# EAGLE design avr-grundschaltung (EAGLE 5.08)
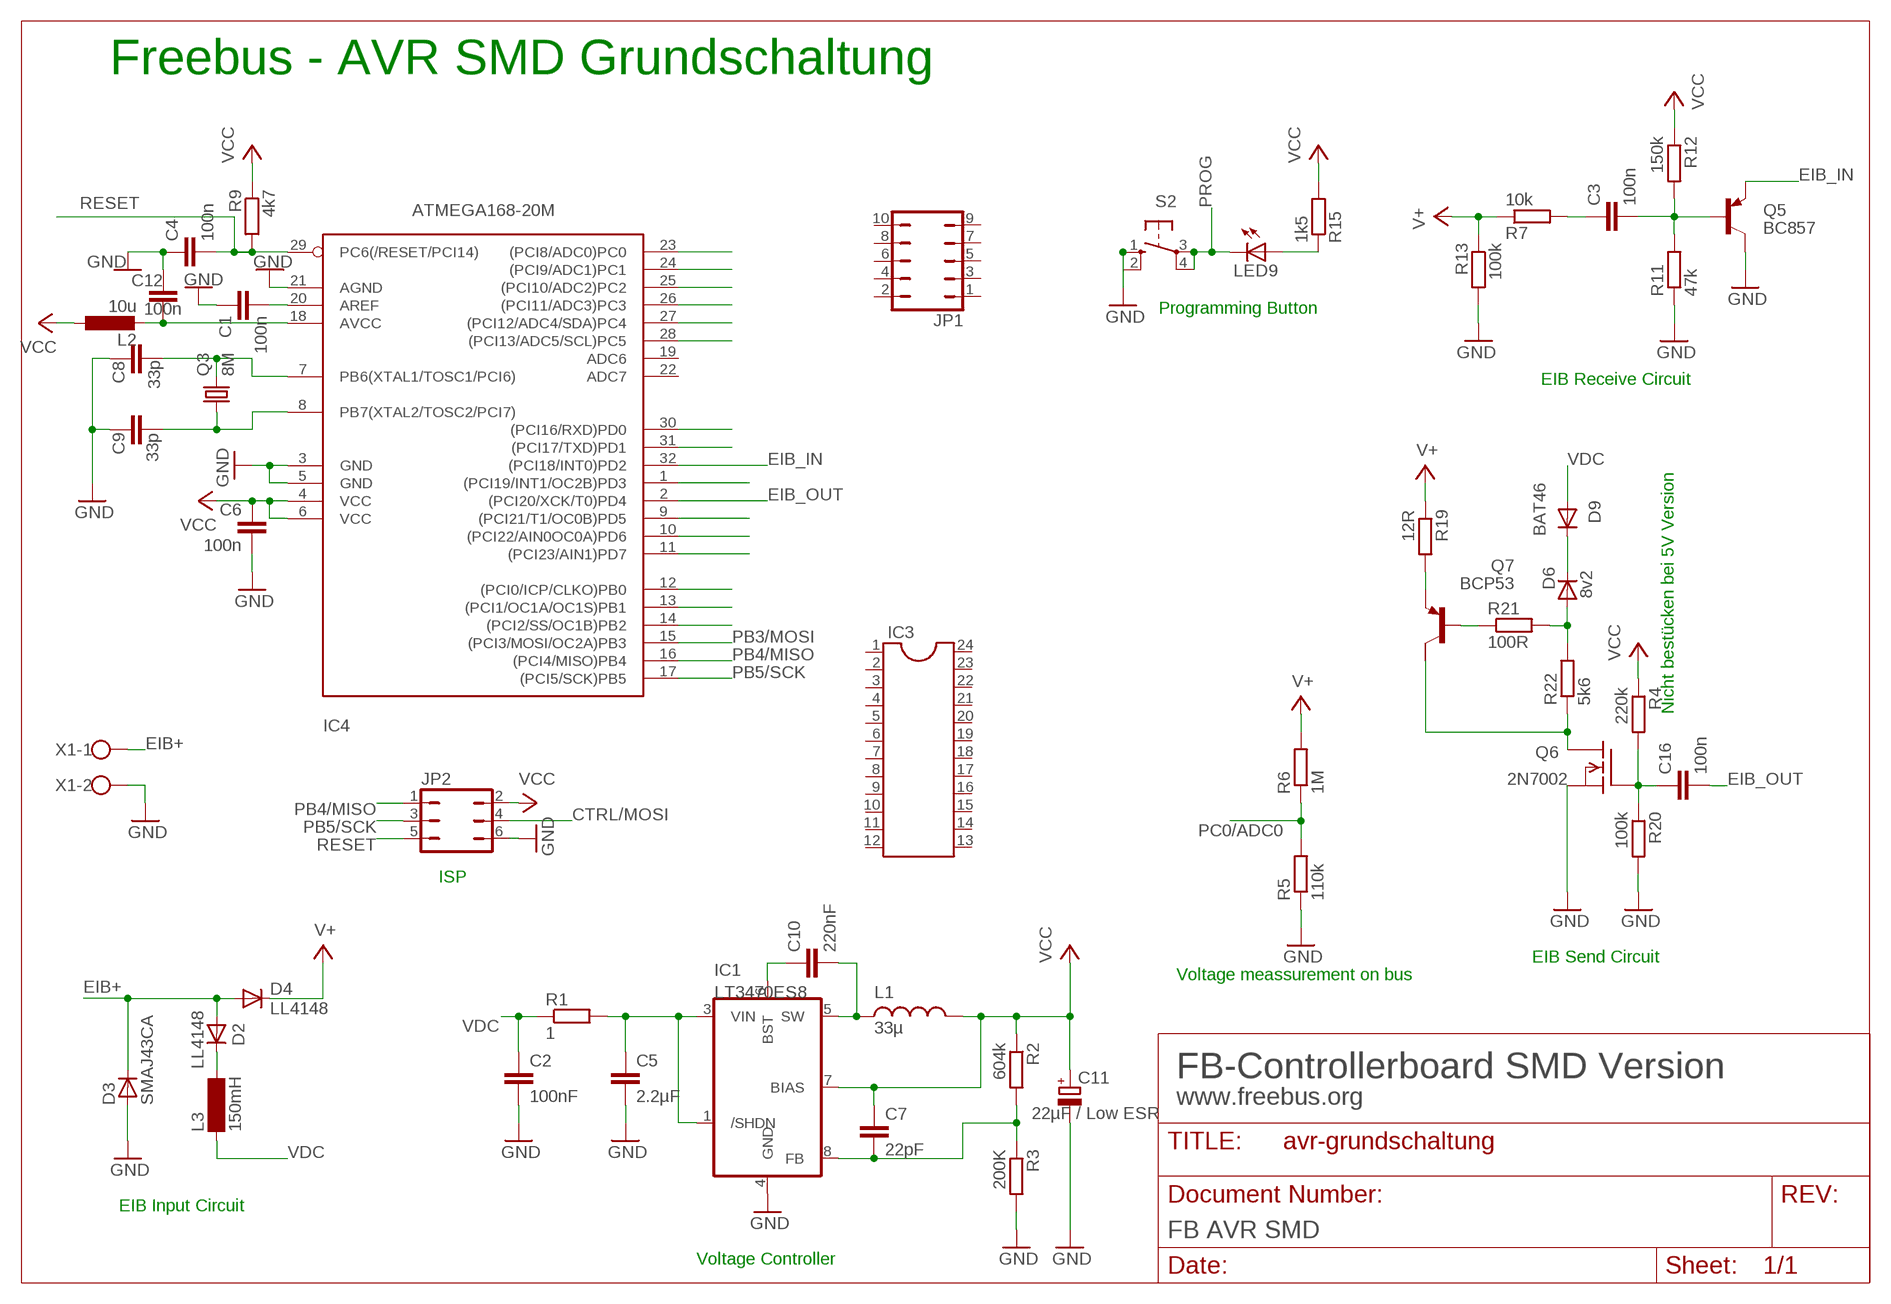
[diagram p0: schematic, sheet 1]

## Parts
C1  100n  C-EUC0603  [C0603]
C2  100nF  C-EUC0805K  [C0805K]
C3  100n  C-EUC0603  [C0603]
C4  100n  C-EUC0603  [C0603]
C5  2.2µF  C-EUC1206K  [C1206K]
C6  100n  C-EUC0603  [C0603]
C7  22pF  C-EUC0603K  [C0603K]
C8  33p  C-EUC0603  [C0603]
C9  33p  C-EUC0603  [C0603]
C10  220nF  C-EUC0805  [C0805]
C11  22µF / Low ESR  CPOL-EUC/6032-28R  [C/6032-28R]
C12  100n  C-EUC0805  [C0805]
C16  100n  C-EUC0603  [C0603]
D2  LL4148  [MINIMELF]
D3  SMAJ43CA  D-  [SMA]
D4  LL4148  [MINIMELF]
D6  8v2  DIODE-MINIMELF  [MINIMELF]
D9  BAT46  DIODE-MINIMELF  [MINIMELF]
IC1  LT3470ES8  LT3470EETS8  [TSOT23-8]
IC3  DIL24-9  [DIL24-9]
IC4  ATMEGA168-20M  [MLF32]
JP1  JP5Q  [JP5Q]
JP2  JP3Q  [JP3Q]
L1  33µ  DS1605C  [DS1605]
L2  10u  L-EUL2825P  [L2825P]
L3  150mH  SD12-1000  [SD12_1000]
LED9  LEDCHIP-LED0805  [CHIP-LED0805]
Q3  8M  CRYSTALHC49UP  [HC49UP]
Q5  BC857  BC857ASMD  [SOT23-BEC]
Q6  2N7002  [SOT23]
Q7  BCP53  FZT753SMD  [SOT223]
R1  1  R-EU_R0805  [R0805]
R2  604k  R-EU_R0805  [R0805]
R3  200K  R-EU_R0805  [R0805]
R4  220k  R-EU_R0603  [R0603]
R5  110k  R-EU_R0805  [R0805]
R6  1M  R-EU_R0805  [R0805]
R7  10k  R-EU_R0603  [R0603]
R9  4k7  R-EU_R0603  [R0603]
R11  47k  R-EU_R0603  [R0603]
R12  150k  R-EU_R0603  [R0603]
R13  100k  R-EU_R0603  [R0603]
R15  1k5  R-EU_R0603  [R0603]
R19  12R  R-EU_R0603  [R0603]
R20  100k  R-EU_R0603  [R0603]
R21  100R  R-EU_R0603  [R0603]
R22  5k6  R-EU_R0603  [R0603]
S2  10-XX  [B3F-10XX]
X1  W237-02P  [W237-132]

## Nets
CTRL/MOSI: JP2.4
EIB+ [supply]: D2.A D3.1(C) D4.A X1.1
EIB_IN: IC4.32((PCI18/INT0)PD2) Q5.E
EIB_OUT: C16.2 IC4.2((PCI20/XCK/T0)PD4)
GND [supply]: C1.1 C2.2 C4.1 C5.2 C6.2 C8.1 C9.1 C11.- C12.1 D3.2(A) IC1.4(GND) IC4.3(GND) IC4.5(GND) IC4.21(AGND) JP2.6 Q5.C Q6.2(S) R3.2 R5.1 R11.1 R13.2 R20.2 S2.1(S) S2.2(S1) X1.2
N$1: C7.2 IC1.8(FB) R2.2 R3.1
N$2: C1.2 IC4.20(AREF)
N$3: C10.1 IC1.6(BST)
N$4: C5.1 IC1.1(/SHDN) IC1.3(VIN) R1.2
N$5: D2.C L3.2
N$6: C12.2 IC4.18(AVCC) L2.2
N$7: C10.2 IC1.5(SW) L1.P$2
N$8: C8.2 IC4.7(PB6(XTAL1/TOSC1/PCI6)) Q3.2
N$9: C9.2 IC4.8(PB7(XTAL2/TOSC2/PCI7)) Q3.1
N$10: C3.1 R7.2
N$15 [supply]: C3.2 Q5.B R11.2 R12.2
N$17 [supply]: Q6.3(D) Q7.2(C) R22.1
N$18 [supply]: Q7.3(E) R19.2
N$19: LED9.A R15.1
N$23 [supply]: Q7.1(B) R21.1
N$25 [supply]: D6.A R21.2 R22.2
N$26: C16.1 Q6.1(G) R4.2 R20.1
N$28 [supply]: D6.C D9.C
PB0: IC4.12((PCI0/ICP/CLKO)PB0)
PB1/OC1A/PWM1: IC4.13((PCI1/OC1A/OC1S)PB1)
PB2/OC1B/PWM2: IC4.14((PCI2/SS/OC1B)PB2)
PB3/MOSI: IC4.15((PCI3/MOSI/OC2A)PB3)
PB4/MISO: IC4.16((PCI4/MISO)PB4) JP2.1
PB5/SCK: IC4.17((PCI5/SCK)PB5) JP2.3
PC0/ADC0: IC4.23((PCI8/ADC0)PC0) R5.2 R6.1
PC1/ADC1: IC4.24((PCI9/ADC1)PC1)
PC2/ADC2: IC4.25((PCI10/ADC2)PC2)
PC3/ADC3: IC4.26((PCI11/ADC3)PC3)
PC4/ADC4/SDA: IC4.27((PCI12/ADC4/SDA)PC4) IC4.28((PCI13/ADC5/SCL)PC5)
PD0/RXD: IC4.30((PCI16/RXD)PD0)
PD1/TXD: IC4.31((PCI17/TXD)PD1)
PD3/INT1: IC4.1((PCI19/INT1/OC2B)PD3)
PD5/T1: IC4.9((PCI21/T1/OC0B)PD5)
PD6/AIN0: IC4.10((PCI22/AIN0OC0A)PD6)
PD7/AIN1: IC4.11((PCI23/AIN1)PD7)
PROG: LED9.C S2.3(P) S2.4(P1)
RESET: C4.2 IC4.29(PC6(/RESET/PCI14)) JP2.5 R9.2
V+ [supply]: D4.C R6.2 R7.1 R13.1 R19.1
VCC [supply]: C6.1 C7.1 C11.+ IC1.7(BIAS) IC4.4(VCC) IC4.6(VCC) JP2.2 L1.P$1 L2.1 R2.1 R4.1 R9.1 R12.1 R15.2
VDC [supply]: C2.1 D9.A L3.1 R1.1
Unconnected: IC3.1 IC3.2 IC3.3 IC3.4 IC3.5 IC3.6 IC3.7 IC3.8 IC3.9 IC3.10 IC3.11 IC3.12 IC3.13 IC3.14 IC3.15 IC3.16 IC3.17 IC3.18 IC3.19 IC3.20 IC3.21 IC3.22 IC3.23 IC3.24 IC4.19(ADC6) IC4.22(ADC7) JP1.1 JP1.2 JP1.3 JP1.4 JP1.5 JP1.6 JP1.7 JP1.8 JP1.9 JP1.10 Q7.4(C/)

## Notes on the sheet
- Freebus - AVR SMD Grundschaltung
- Programming Button
- EIB Receive Circuit
- Nicht bestücken bei 5V Version
- ISP
- EIB Send Circuit
- Voltage meassurement on bus
- FB-Controllerboard SMD Version
- www.freebus.org
- EIB Input Circuit
- FB AVR SMD
- Voltage Controller

## Library data of the parts
C1-C10 C12 C16 = rcl:C-EU: CAPACITOR, European symbol
C11 = rcl:CPOL-EU: POLARIZED CAPACITOR, European symbol
D2 D4 = diode-os:LL4148
D3 = own:D-: DIODE unfilled
D6 D9 = diode:DIODE-: DIODE
IC1 = own:LT3470*: Micropower Buck Regulator
IC3 = ic-package:DIL24: Dual In Line
IC4 = avr:ATMEGA168: MICROCONTROLLER 16 kBytes FLASH 1 kBytes SRAM 512 Bytes EEPROM USART 8-channel 10 bit ADC
JP1 = jumper:JP5Q: JUMPER
JP2 = jumper:JP3Q: JUMPER
L1 = own:DS1605: SMT Power Inductors
L2 = rcl:L-EU: INDUCTOR, European symbol
L3 = inductor-neosid:SD12: INDUCTOR nominal inductance
LED9 = led:LED: LED OSRAM: - CHIPLED LG R971, LG N971, LY N971, LG Q971, LY Q971, LO R971, LY R971 LH N974, LH R974 LS Q976, LO Q976, LY Q976 LO Q996 - Hyper CHIPLED LW Q18S LB Q993, LB Q99A, LB R99A - SideLED LS A670, LO A670, LY A670, LG A670, LP A670 LB A673, LV A673, LT A673, LW A673 LH A674 LY A675 LS A676, LA A676, LO A676, LY A676, LW A676 LS A679, LY A679, LG A679 - Hyper Micro SIDELED® LS Y876, LA Y876, LO Y876, LY Y876 LT Y87S - SmartLED LW L88C, LW L88S LB L89C, LB L89S, LG L890 LS L89K, LO L89K, LY L89K LS L896, LA L896, LO L896, LY L896 - TOPLED LS T670, LO T670, LY T670, LG T670, LP T670 LSG T670, LSP T670, LSY T670, LOP T670, LYG T670 LG T671, LOG T671, LSG T671 LB T673, LV T673, LT T673, LW T673 LH T674 LS T676, LA T676, LO T676, LY T676, LB T676, LH T676, LSB T676, LW T676 LB T67C, LV T67C, LT T67C, LS T67K, LO T67K, LY T67K, LW E67C LS E67B, LA E67B, LO E67B, LY E67B, LB E67C, LV E67C, LT E67C LW T67C LS T679, LY T679, LG T679 LS T770, LO T770, LY T770, LG T770, LP T770 LB T773, LV T773, LT T773, LW T773 LH T774 LS E675, LA E675, LY E675, LS T675 LS T776, LA T776, LO T776, LY T776, LB T776 LHGB T686 LT T68C, LB T68C - Hyper Mini TOPLED® LB M676 - Mini TOPLED Santana® LG M470 LS M47K, LO M47K, LY M47K Source: http://www.osram.convergy.de LUXEON: - LUMILED® LXK2-PW12-R00, LXK2-PW12-S00, LXK2-PW14-U00, LXK2-PW14-V00 LXK2-PM12-R00, LXK2-PM12-S00, LXK2-PM14-U00 LXK2-PE12-Q00, LXK2-PE12-R00, LXK2-PE12-S00, LXK2-PE14-T00, LXK2-PE14-U00 LXK2-PB12-K00, LXK2-PB12-L00, LXK2-PB12-M00, LXK2-PB14-N00, LXK2-PB14-P00, LXK2-PB14-Q00 LXK2-PR12-L00, LXK2-PR12-M00, LXK2-PR14-Q00, LXK2-PR14-R00 LXK2-PD12-Q00, LXK2-PD12-R00, LXK2-PD12-S00 LXK2-PH12-R00, LXK2-PH12-S00 LXK2-PL12-P00, LXK2-PL12-Q00, LXK2-PL12-R00 Source: www.luxeon.com KINGBRIGHT: KA-3528ASYC Source: www.kingbright.com
Q3 = crystal:CRYSTAL: CRYSTAL
Q5 = transistor-pnp:BC857*: PNP Transistror
Q6 = freebus:2N7002
Q7 = transistor-pnp:FZT753SMD: PNP Transistor
R1-R7 R9 R11-R13 R15 R19-R22 = rcl:R-EU_: RESISTOR, European symbol
S2 = switch-omron:10-XX: OMRON SWITCH
X1 = con-wago-508:W237-02P: WAGO SREW CLAMP

## Net classes
0 default: width 0.203 mm
1 supply: width 0.254 mm

## Board
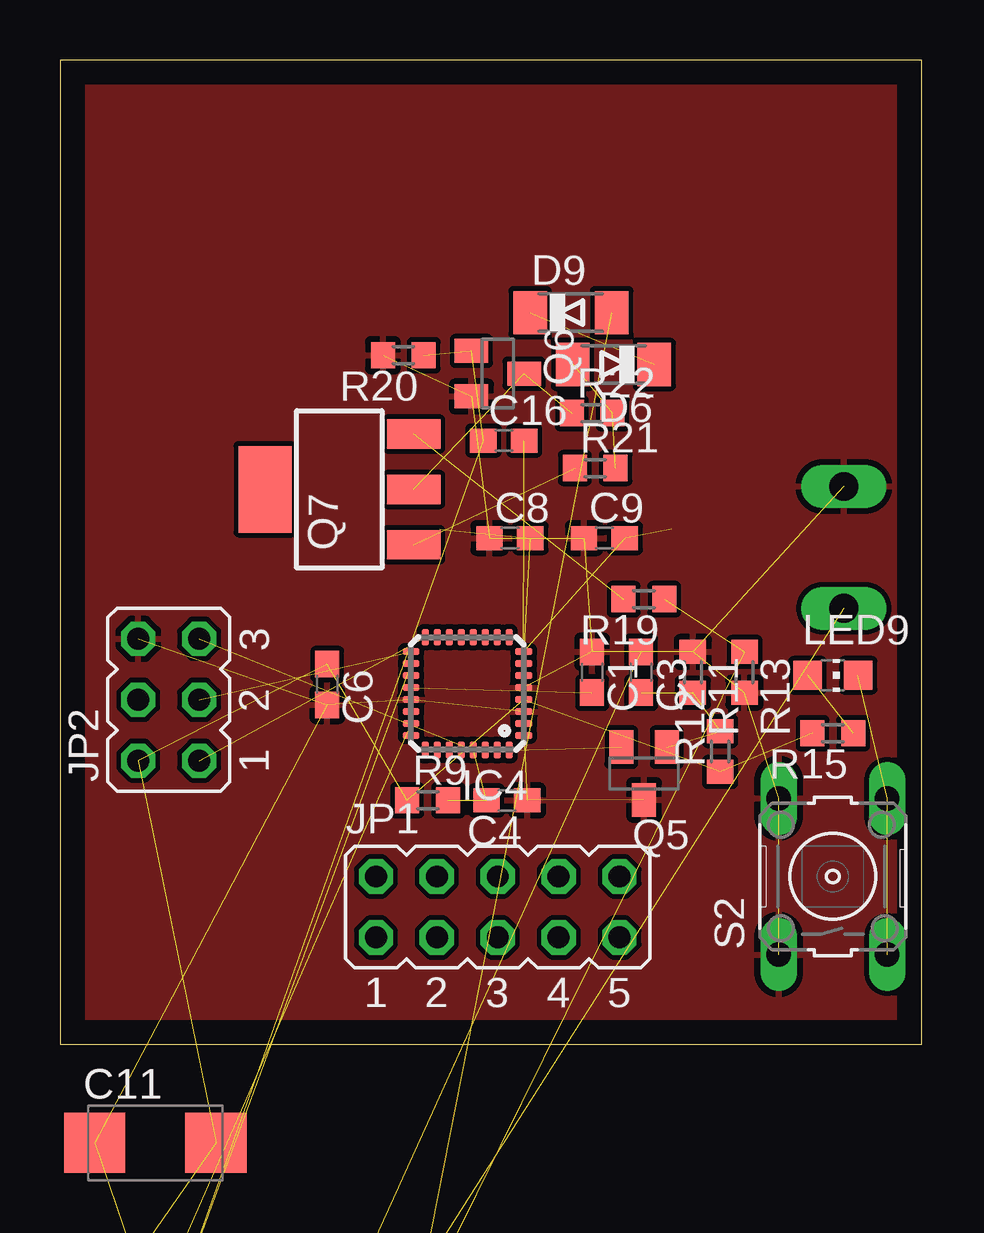
[diagram p1: board, top side]
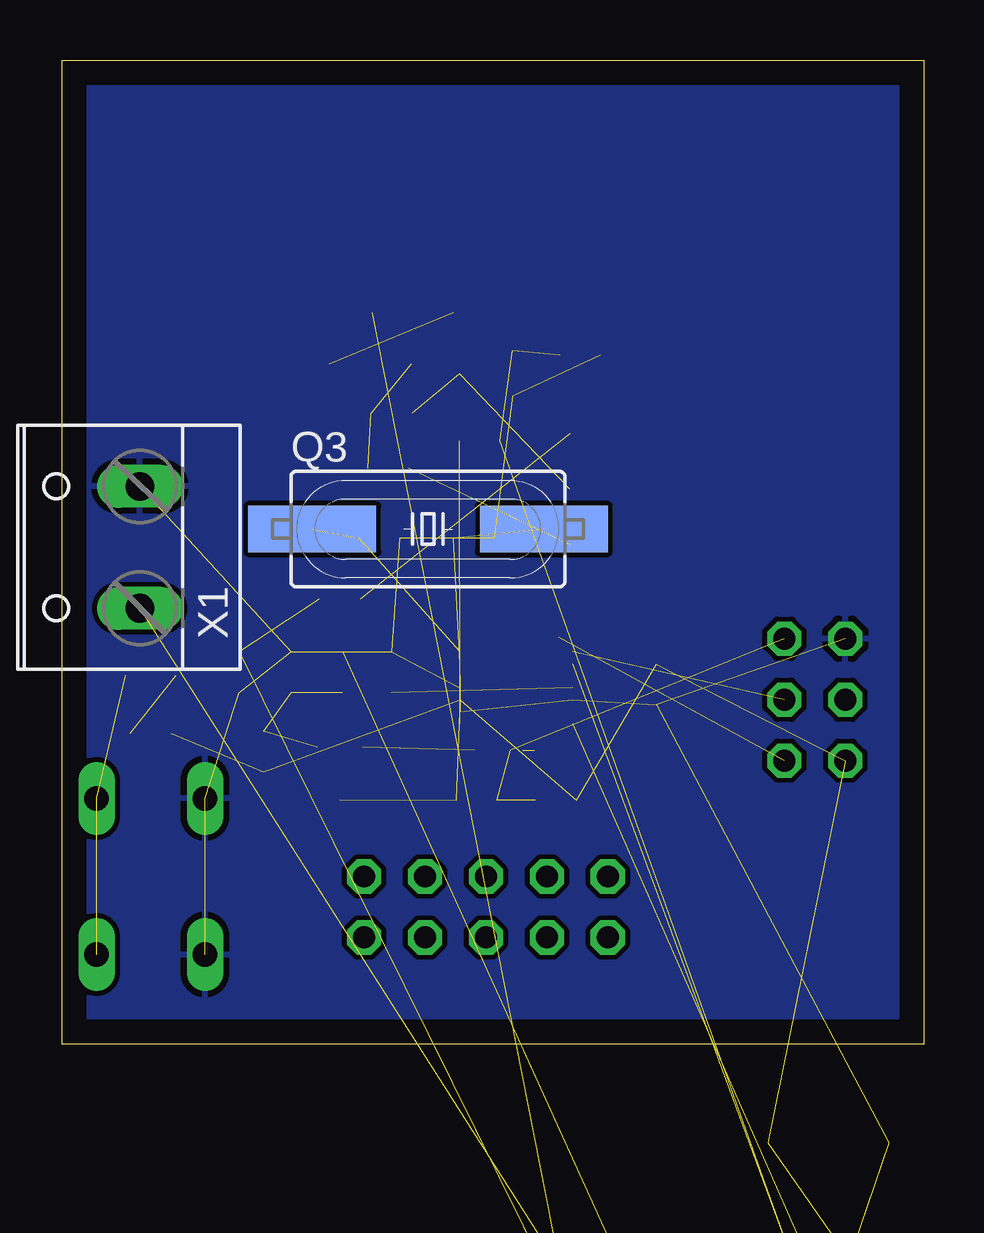
[diagram p2: board, bottom side, seen from below]

Size 35.92 x 41 mm. Coordinates in mm from the lower left corner, seen from the top.
Outline: 0,0 35.92,0 35.92,41 0,41 0,0
Copper layers (1*16): Top 0.035mm / dielectric 1.5mm / Bottom 0.035mm
Design rules "default *": minimum track width 5mil, minimum drill 12mil, track to track 8mil, track to pad 8mil, pad to pad 8mil, via to via 8mil, smd to smd 8mil, copper to edge 40mil, drill to drill 8mil, minimum pad ring 10mil, minimum via ring 8mil, stop-mask expansion 4mil, vias tented up to drill 0mil, thermal gap 10mil

### Footprints (pad centres in the part's own frame; a part is rotated, then mirrored left to right if it is on the bottom)
C0603 = smd 1.1 x 1: 1 -0.85,0; 2 0.85,0
C0805K = smd 1.3 x 1.6: 1 -1,0; 2 1,0
C1206K = smd 1.5 x 2: 1 -1.5,0; 2 1.5,0
C0603K = smd 1.05 x 1.08: 1 -0.875,0; 2 0.875,0
C0805 = smd 1.3 x 1.5: 1 -0.95,0; 2 0.95,0
C/6032-28R = smd 2.55 x 2.5: + 2.525,0; - -2.525,0
MINIMELF = smd 1.4 x 1.8: A 1.7,0; C -1.7,0
SMA = smd 1.67 x 1.73: 1 -1.576,0; 2 1.58,0.014
TSOT23-8 = smd 0.44 x 1.22: 1 -0.975,-1.31; 2 -0.325,-1.31; 3 0.325,-1.31; 4 0.975,-1.31; 5 0.975,1.31; 6 0.325,1.31; 7 -0.325,1.31; 8 -0.975,1.31
DIL24-9 = drill 0.813 long: 1 -13.97,-11.43; 2 -11.43,-11.43; 3 -8.89,-11.43; 4 -6.35,-11.43; 5 -3.81,-11.43; 6 -1.27,-11.43; 7 1.27,-11.43; 8 3.81,-11.43; 9 6.35,-11.43; 10 8.89,-11.43; 11 11.43,-11.43; 12 13.97,-11.43; 13 13.97,11.43; 14 11.43,11.43; 15 8.89,11.43; 16 6.35,11.43; 17 3.81,11.43; 18 1.27,11.43; 19 -1.27,11.43; 20 -3.81,11.43; 21 -6.35,11.43; 22 -8.89,11.43; 23 -11.43,11.43; 24 -13.97,11.43
MLF32 = smd 0.7 x 0.3: 1 -2.35,1.75; 2 -2.35,1.25; 3 -2.35,0.75; 4 -2.35,0.25; 5 -2.35,-0.25; 6 -2.35,-0.75; 7 -2.35,-1.25; 8 -2.35,-1.75; 17 2.35,-1.75; 18 2.35,-1.25; 19 2.35,-0.75; 20 2.35,-0.25; 21 2.35,0.25; 22 2.35,0.75; 23 2.35,1.25; 24 2.35,1.75 | smd 0.3 x 0.7: 9 -1.75,-2.35; 10 -1.25,-2.35; 11 -0.75,-2.35; 12 -0.25,-2.35; 13 0.25,-2.35; 14 0.75,-2.35; 15 1.25,-2.35; 16 1.75,-2.35; 25 1.75,2.35; 26 1.25,2.35; 27 0.75,2.35; 28 0.25,2.35; 29 -0.25,2.35; 30 -0.75,2.35; 31 -1.25,2.35; 32 -1.75,2.35
JP5Q = drill 0.914 octagon: 1 -5.08,-1.27; 2 -5.08,1.27; 3 -2.54,-1.27; 4 -2.54,1.27; 5 0,-1.27; 6 0,1.27; 7 2.54,-1.27; 8 2.54,1.27; 9 5.08,-1.27; 10 5.08,1.27
JP3Q = drill 0.914 octagon: 1 -2.54,-1.27; 2 -2.54,1.27; 3 0,-1.27; 4 0,1.27; 5 2.54,-1.27; 6 2.54,1.27
DS1605 = smd 1 x 4.4: P$1 -2.38,0; P$2 2.38,0
L2825P = smd 1.4 x 2.4: 1 -1.2,0; 2 1.2,0
SD12_1000 = drill 1.1 long: 1 -2.5,0; 2 2.5,0
CHIP-LED0805 = smd 1.2 x 1.2: A 0,-1.05; C 0,1.05
HC49UP = smd 5.334 x 1.93: 1 -4.826,0; 2 4.826,0
SOT23-BEC = smd 1 x 1.4: B -0.95,-1.1; C 0,1.1; E 0.95,-1.1
SOT23 = smd 1 x 1.4: 1 -0.95,-1.1; 2 0.95,-1.1; 3 0,1.1
SOT223 = smd 1.219 x 2.235: 1 -2.311,-3.099; 2 0,-3.099; 3 2.311,-3.099 | smd 3.6 x 2.2: 4 0,3.099
R0805 = smd 1.3 x 1.5: 1 -0.95,0; 2 0.95,0
R0603 = smd 1 x 1.1: 1 -0.85,0; 2 0.85,0
B3F-10XX = drill 1.016 long: 1 -3.251,2.261; 2 3.251,2.261; 3 -3.251,-2.261; 4 3.251,-2.261
W237-132 = drill 1.194 long: 1 -2.54,-0.635; 2 2.54,-0.635

### Placement (x,y rotation side)
C1  22.19,15.49 270 top
C2  12.99,-25.46 0 top  (outside the outline)
C3  24.22,15.49 270 top
C4  18.63,10.16 180 top
C5  7.25,-25.46 0 top  (outside the outline)
C6  11.14,14.98 270 top
C7  1.51,-32.01 0 top  (outside the outline)
C8  18.76,21.08 0 top
C9  22.7,21.08 0 top
C10  2.32,-19.69 0 top  (outside the outline)
C11  3.98,-4.12 0 top  (outside the outline)
C12  -19.11,-73.72 0 top  (outside the outline)
C16  18.5,25.14 0 top
D2  -2.53,-45.27 0 top  (outside the outline)
D3  -1.71,-38.31 0 top  (outside the outline)
D4  -3.26,-51.36 0 top  (outside the outline)
D6  23.08,28.32 180 top
D9  21.3,30.47 0 top
IC1  3.16,-10.67 0 top  (outside the outline)
IC3  57.62,16.63 0 top  (outside the outline)
IC4  16.98,14.6 180 top
JP1  18.25,5.71 0 top
JP2  4.53,14.35 90 top
L1  20.41,-25.43 0 top  (outside the outline)
L2  -17.87,-69.12 0 top  (outside the outline)
L3  -13.3,-48.37 0 top  (outside the outline)
LED9  32.22,15.36 270 top
Q3  20.66,21.46 0 bottom
Q5  24.35,11.27 180 top
Q6  18.25,27.93 270 top
Q7  11.65,23.11 90 top
R1  2.38,-26.27 0 top  (outside the outline)
R2  10.53,-19.72 0 top  (outside the outline)
R3  17.92,-19.69 0 top  (outside the outline)
R4  -3.47,-31.6 0 top  (outside the outline)
R5  -17.54,-57.61 0 top  (outside the outline)
R6  -17.95,-62.23 0 top  (outside the outline)
R7  -20.03,-79.33 0 top  (outside the outline)
R9  15.33,10.16 0 top
R11  26.38,15.49 270 top
R12  27.52,12.19 90 top
R13  28.54,15.49 270 top
R15  32.22,12.95 180 top
R19  24.35,18.54 180 top
R20  14.31,28.7 180 top
R21  22.31,24 0 top
R22  22.19,26.28 0 top
S2  32.22,6.98 90 top
X1  33.31,20.7 90 bottom

### Tracks (layer width: path | path; a pad name or v marks a point on that pad's centre or on a via)
EIB+  (3 unrouted)
EIB_IN  (1 unrouted)
EIB_OUT  (1 unrouted)
GND  (24 unrouted)
  pour Bottom: 0.22,40.76 35.78,40.76 35.78,0.12 0.22,0.12
  pour Top: 0.22,40.76 35.78,40.76 35.78,0.12 0.22,0.12
N$1  (3 unrouted)
N$2  (1 unrouted)
N$3  (1 unrouted)
N$4  (3 unrouted)
N$5  (1 unrouted)
N$6  (2 unrouted)
N$7  (2 unrouted)
N$8  (2 unrouted)
N$9  (2 unrouted)
N$10  (1 unrouted)
N$15  (3 unrouted)
N$17  (2 unrouted)
N$18  (1 unrouted)
N$19  (1 unrouted)
N$23  (1 unrouted)
N$25  (2 unrouted)
N$26  (3 unrouted)
N$28  (1 unrouted)
PB4/MISO  (1 unrouted)
PB5/SCK  (1 unrouted)
PC0/ADC0  (2 unrouted)
PC4/ADC4/SDA  (1 unrouted)
PROG  (2 unrouted)
RESET  (3 unrouted)
V+  (4 unrouted)
VCC  (13 unrouted)
VDC  (3 unrouted)